# Altium schematic sheet Cegep.schdoc: TITRE
size Letter; ApprovedBy: APPROUVÉ PAR; Organization: Cegep Limoilou; Address1: 1300, 8e Avenue; Address2: Québec, QC; Address3: Canada; Address4: G1J 5L5; SheetNumber: 2; SheetTotal: 3
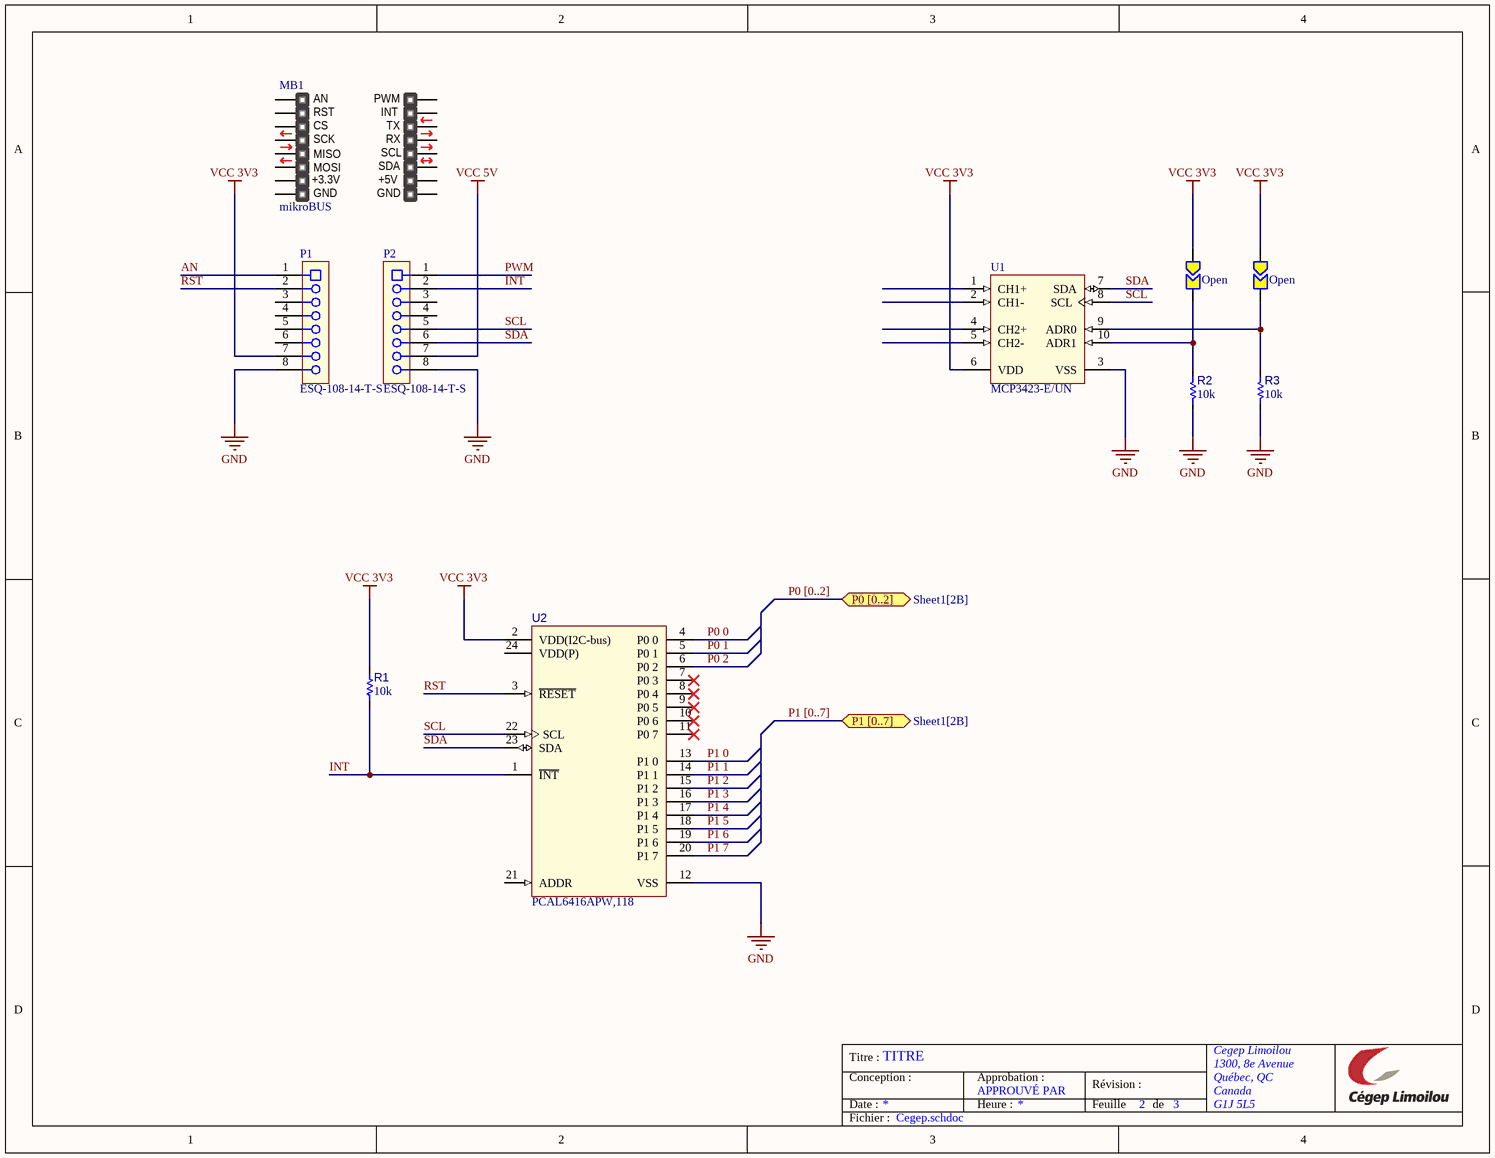
[diagram p0: Cegep.schdoc]

## Parts
MB1  mikroBUS  [mikroBUS - Large]  (no BOM)
P1  ESQ-108-14-T-S  [CONN_SKT_01X08_100MIL-ELEVATED-LONGPIN]
P2  ESQ-108-14-T-S  [CONN_SKT_01X08_100MIL-ELEVATED-LONGPIN]
R1  value 10k  [R_1005[0402]]  (hidden comment: Res 10k 1% 0402)
R2  value 10k  [R_1005[0402]]  (hidden comment: Res 10k 1% 0402)
R3  value 10k  [R_1005[0402]]  (hidden comment: Res 10k 1% 0402)
SB1  Open  [SB-TINY-OPEN]  (no BOM)
SB?  Open  [SB-TINY-OPEN]  (no BOM)
U1  MCP3423-E/UN  [U_MSOP50P300X500-10(RM-10)_WO-TP]
U2  PCAL6416APW,118  [U_TSSOP24_SOT355-1-IPC_B]

## Ports
P0 [0..2] (bidir, see Sheet1[2B]), P1 [0..7] (bidir, see Sheet1[2B])

## Nets
GND: P1.8 P2.8 R2.2 R3.2 U1.3(VSS) U2.12(VSS)
VCC 3V3: P1.7 R1.1 SB1.1 SB?.1 U1.6(VDD) U2.2(VDD(I2C-bus))
VCC 5V: P2.7
AN: P1.1
INT: P2.2 R1.2 U2.1(~{INT})
P0 0: U2.4(P0_0)
P0 1: U2.5(P0_1)
P0 2: U2.6(P0_2)
P1 0: U2.13(P1_0)
P1 1: U2.14(P1_1)
P1 2: U2.15(P1_2)
P1 3: U2.16(P1_3)
P1 4: U2.17(P1_4)
P1 5: U2.18(P1_5)
P1 6: U2.19(P1_6)
P1 7: U2.20(P1_7)
PWM: P2.1
RST: P1.2 U2.3(~{RESET})
SCL: P2.5 U1.8(SCL) U2.22(SCL)
SDA: P2.6 U1.7(SDA) U2.23(SDA)
NetR2_1: R2.1 SB1.2 U1.10(ADR1)
NetR3_1: R3.1 SB?.2 U1.9(ADR0)

Not connected (* = marked no-connect by the designer): MB1 1(AN) 2(RST) 3(CS) 4(SCK) 5(MISO) 6(MOSI) 7(3.3V) 8(GND) 9(GND) 10(5V) 11(SDA) 12(SCL) 13(TX) 14(RX) 15(INT) 16(PWM); P1 3 4 5 6; P2 3 4; U1 1(CH1+) 2(CH1-) 4(CH2+) 5(CH2-); U2 7(P0_3)* 8(P0_4)* 9(P0_5)* 10(P0_6)* 11(P0_7)* 21(ADDR) 24(VDD(P))

## Buses and harness runs
bus P0 [0..2] = port P0 [0..2]
bus P1 [0..7] = port P1 [0..7]

## Notes on the sheet
- Titre :
- Conception :
- Date :
- Approbation :
- Heure :
- Révision :
- Feuille
- de
- Fichier :
- (in symbol mikroBUS compatible add-on board) +3.3V; +5V

## Library data of the parts
MB1 = mikroBUS compatible add-on board
P1 P2 = CONN-100MIL-SKT-01X08_ELEVATED_LONGPIN: CONN SOCKET 8pos 100mils Elevated; Manufacturer 1: Samtec; Mounting Technology: TH; Manufacturer Part Number 1: ESQ-108-14-T-S; Supplier 1: Digikey; Supplier Part Number 1: SAM9303-ND
R1-R3 = RES003: Resistor type 1; Manufacturer 1: Yageo; Manufacturer Part Number 1: RC0402FR-0710KL; LibRef: RES003; Puissance: 1/16W; Max Working Voltage: 50V; Tolerance: 1%; Mounting Technology: SMT; Supplier 1: LCSC; Supplier Part Number 1: C60490
SB1 SB? = Solder-Jumper-Open: Solder Jumper
U1 = U_MCP3423-E/UN: CAN Controller Stand-Alone With SPI, 18-Pin PDIP; Manufacturer 1: Microchip; Manufacturer Part Number 1: MCP3423-E/UN; Supplier 1: LCSC; Supplier Part Number 1: C220864; Mounting Technology: SMT; Supplier 2: Digikey; Supplier Part Number 2: MCP3423-E/UN-ND
U2 = U_PCAL6416APW: IC I/O EXPANDER 16BIT 24TSSOP; Manufacturer Part Number 1: TCA6416APWR; Manufacturer 1: Texas Instruments; Manufacturer 2: NXP Semiconductors; Manufacturer Part Number 2: PCAL6416APW,118; Mounting Technology: SMT; Supplier 1: LCSC; Supplier 2: LCSC; Supplier 3: Digikey; Supplier Part Number 1: C130203; Supplier Part Number 2: C2652299; Supplier Part Number 3: 568-9922-1-ND